# EAGLE schematic GPS_radiologger_v5 (EAGLE 9.5.1)
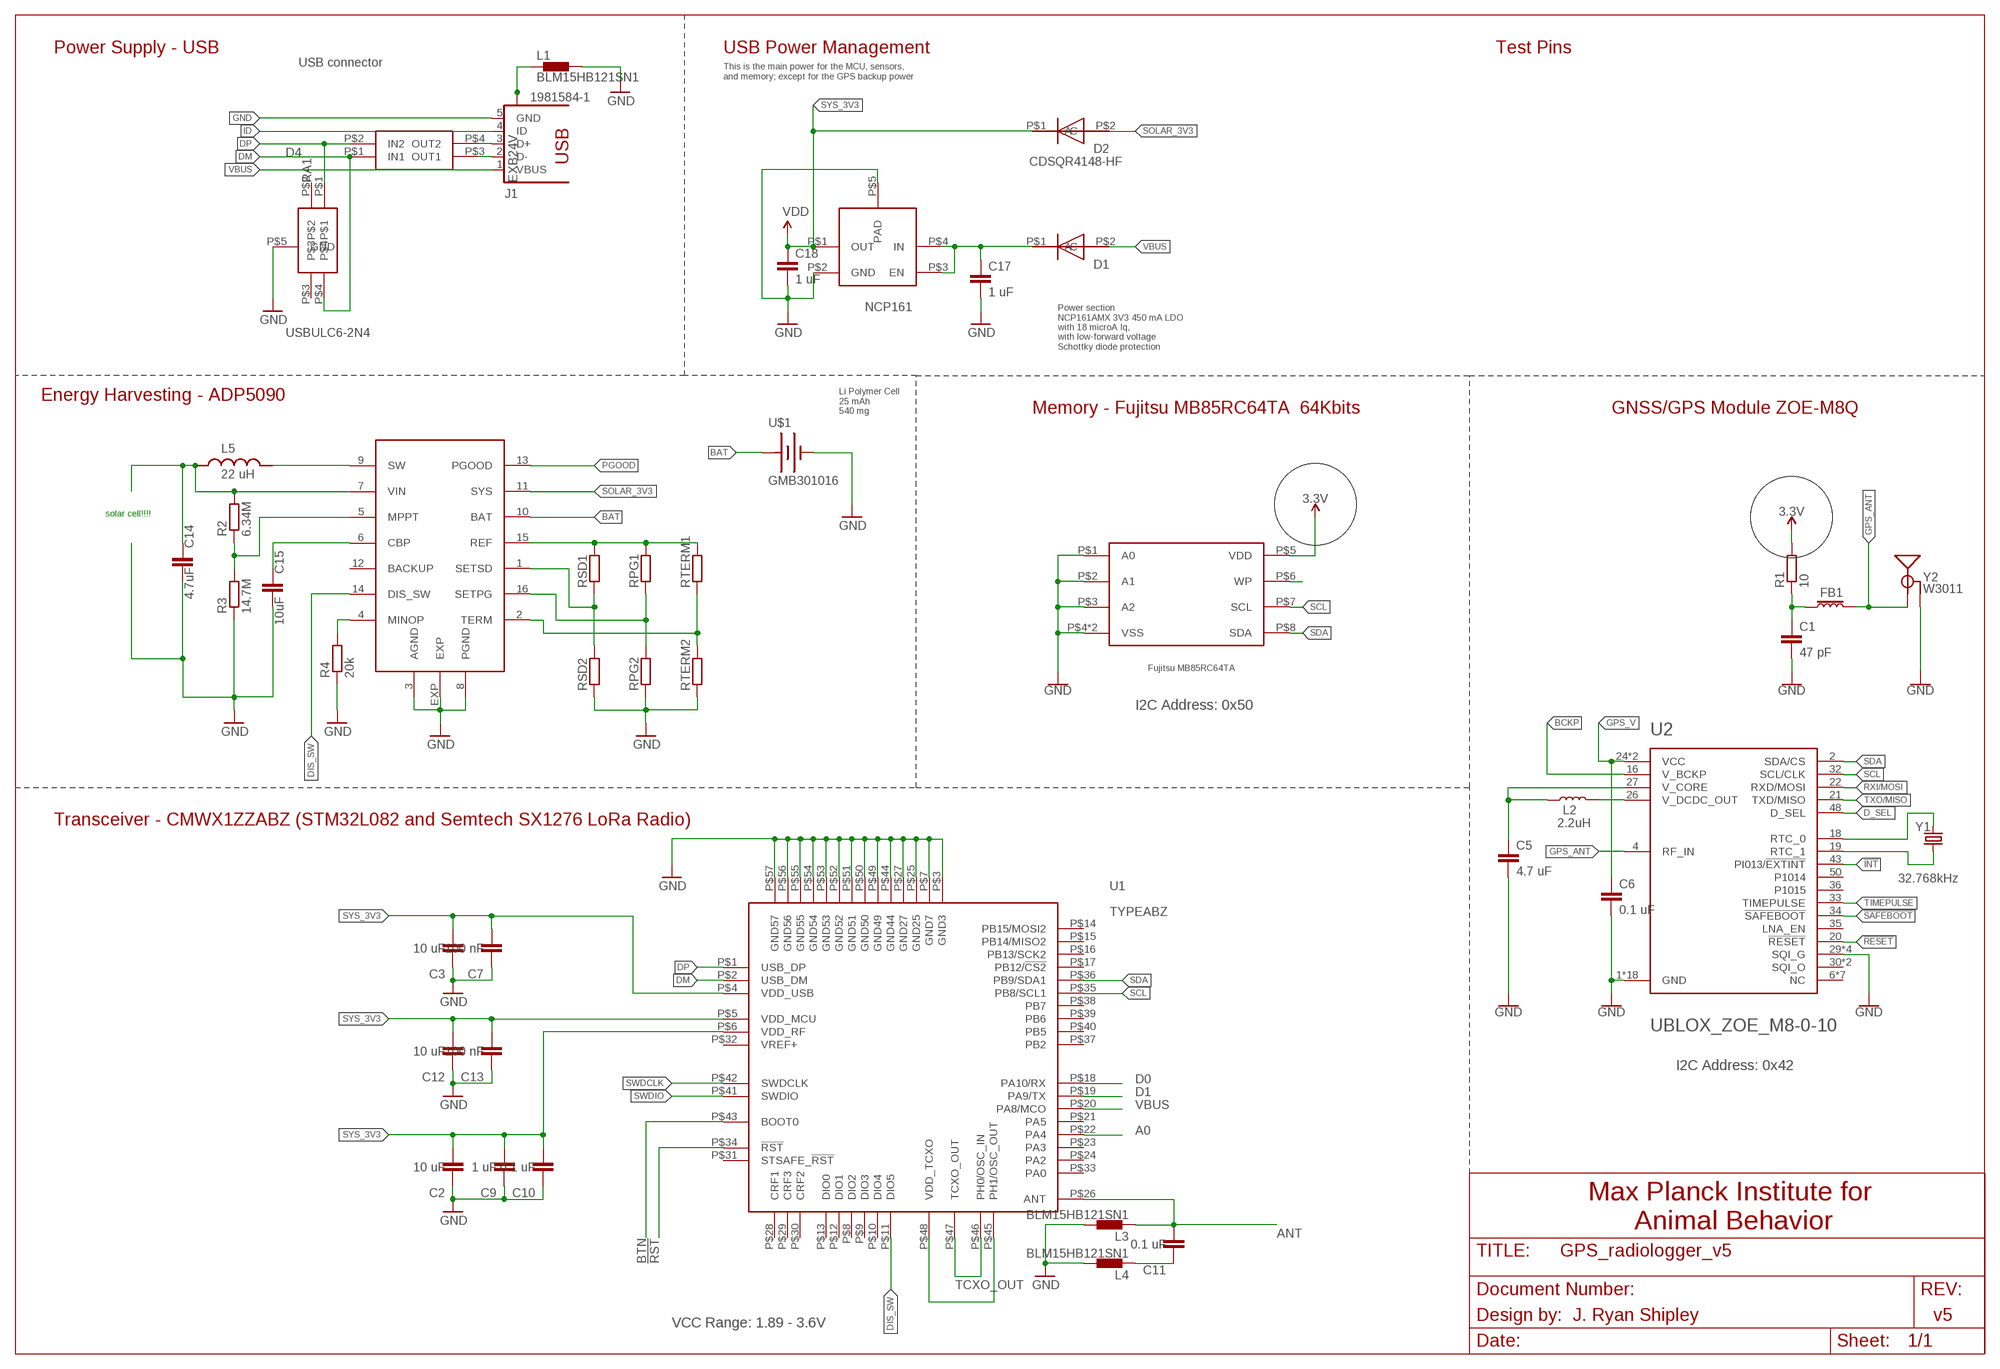
[diagram p0: schematic, sheet 1]

## Parts
C1  47 pF  C-EUC0201  [C0201]
C2  10 uF  C-EUC0201  [C0201]
C3  10 uF  C-EUC0201  [C0201]
C5  4.7 uF  C-EUC0201  [C0201]
C6  0.1 uF  C-EUC0201  [C0201]
C7  100 nF  C-EUC0201  [C0201]
C9  1 uF  C-EUC0201  [C0201]
C10  0.1 uF  C-EUC0201  [C0201]
C11  0.1 uF  C-EUC0201  [C0201]
C12  10 uF  C-EUC0201  [C0201]
C13  100 nF  C-EUC0201  [C0201]
C14  4.7uF  C-EUC0402  [C0402]
C15  10uF  C-EUC0402  [C0402]
C17  1 uF  0402CAP.KW  [0402-CAP]
C18  1 uF  0402CAP.KW  [0402-CAP]
D1  CDSQR4148-HF  [CDSQR4148-HF]
D2  CDSQR4148-HF  [CDSQR4148-HF]
D4  USBULC6-2N4  [USBULC6-2N4]
FB1  FERRITE_BEAD-120_OHM-0402  [0402]
J1  1981584-1  [1981584-1]
L1  BLM15HB121SN1  [0402]
L2  2.2uH  2.2μH_SHIELDED_INDUCTOR  [0806]
L3  BLM15HB121SN1  [0402]
L4  BLM15HB121SN1  [0402]
L5  22 uH  LPS4012-103MRB  [IND_LPS4012-103MRB]
R1  10  R-EU_R0201  [R0201]
R2  6.34M  R-EU_R0201  [R0201]
R3  14.7M  R-EU_R0201  [R0201]
R4  20k  R-EU_R0201  [R0201]
RA1  EXB24V  [EXB24V]
RPG1  R-EU_R0201  [R0201]
RPG2  R-EU_R0201  [R0201]
RSD1  R-EU_R0402  [R0402]
RSD2  R-EU_R0201  [R0201]
RTERM1  R-EU_R0402  [R0402]
RTERM2  R-EU_R0201  [R0201]
U1  TYPEABZ  [TYPEABZ]
U2  UBLOX_ZOE_M8-0-10  [UBLOX_ZOE_M8-0-10]
U5  NCP161  [NCP161]
U$1  GMB301016  [GMB301016]
U$2  MB85RC64TA  [8-SON_2X3]
U$3  ADP5090  [LFCSP-16-3X3]
Y1  32.768kHz  CRYSTAL-32.768KHZSMD-3.2X1.5  [CRYSTAL-SMD-3.2X1.5MM]
Y2  W3011  GPS_CHIP_ANTENNAW3011  [W3011]

## Nets
3.3V: R1.2 U$2.P$5(VDD)
!INT: U2.43(PI013/!EXTINT)
!RESET: U2.20(!RESET)
!RST: U1.P$34(!RST)
!SAFEBOOT: U2.34(!SAFEBOOT)
A0: U1.P$22(PA4)
ANT: C11.1 L4.1
BAT: U$1.+ U$3.10(BAT)
BCKP: U2.16(V_BCKP)
BTN: U1.P$43(BOOT0)
D0: U1.P$18(PA10/RX)
D1: U1.P$19(PA9/TX)
D_SEL: U2.48(D_SEL)
DIS_SW: U1.P$11(DIO5) U$3.14(DIS_SW)
DM: D4.P$4 RA1.P$1(IN1) U1.P$2(USB_DM)
DP: D4.P$1 RA1.P$2(IN2) U1.P$1(USB_DP)
GND: C1.2 C2.1 C3.1 C5.2 C6.2 C7.1 C9.1 C10.1 C12.1 C13.1 C14.2 C15.2 C17.2 C18.2 D4.P$5(GND) J1.5(GND) L1.2 L3.2 L4.2 R3.1 R4.1 RPG2.1 RSD2.1 RTERM2.1 U1.P$3(GND3) U1.P$7(GND7) U1.P$25(GND25) U1.P$27(GND27) U1.P$44(GND44) U1.P$49(GND49) U1.P$50(GND50) U1.P$51(GND51) U1.P$52(GND52) U1.P$53(GND53) U1.P$54(GND54) U1.P$55(GND55) U1.P$56(GND56) U1.P$57(GND57) U2.1(GND) U2.3(GND) U2.5(GND) U2.7(GND) U2.8(GND) U2.9(GND) U2.10(GND) U2.11(GND) U2.12(GND) U2.17(GND) U2.23(GND) U2.29(SQI_G) U2.31(SQI_G) U2.37(GND) U2.38(GND) U2.39(GND) U2.40(GND) U2.41(GND) U2.44(GND) U2.46(SQI_G) U2.47(SQI_G) U2.49(GND) U5.P$2(GND) U5.P$5(PAD) U$1.- U$2.P$1(A0) U$2.P$2(A1) U$2.P$3(A2) U$2.P$4(VSS) U$2.P$9(VSS) Y2.2(GND) Y2.3(GND)
GPS_ANT: FB1.1 U2.4(RF_IN) Y2.1(SIGNAL)
GPS_V: C6.1 U2.24(VCC) U2.25(VCC)
ID: J1.4(ID)
N$1: U1.P$45(PH1/OSC_OUT) U1.P$48(VDD_TCXO)
N$3: U$2.P$6(WP)
N$4: L2.2 U2.26(V_DCDC_OUT)
N$5: L5.2 U$3.9(SW)
N$6: U$3.3(AGND) U$3.8(PGND) U$3.EXP ; supply symbol labelled GND
N$7: R2.1 R3.2 U$3.5(MPPT)
N$8: C15.1 U$3.6(CBP)
N$9: C1.1 FB1.2 R1.1
N$10: R4.2 U$3.4(MINOP)
N$11: RTERM1.1 RTERM2.2 U$3.2(TERM)
N$12: RPG1.1 RPG2.2 U$3.16(SETPG)
N$13: C5.1 L2.1 U2.27(V_CORE)
N$14: U2.18(RTC_0) Y1.P$2
N$15: U2.19(RTC_1) Y1.P$1
N$16: RSD1.1 RSD2.2 U$3.1(SETSD)
N$17: RPG1.2 RSD1.2 RTERM1.2 U$3.15(REF)
N$31: J1.3(D+) RA1.P$4(OUT2)
N$32: C11.2 L3.1 U1.P$26(ANT)
N$33: J1.2(D-) RA1.P$3(OUT1)
N$60: C17.1 D1.P$1(C) U5.P$3(EN) U5.P$4(IN)
PGOOD: U$3.13(PGOOD)
RXI/MOSI: U2.22(RXD/MOSI)
SCL: U1.P$35(PB8/SCL1) U2.32(SCL/CLK) U$2.P$7(SCL)
SDA: U1.P$36(PB9/SDA1) U2.2(SDA/CS) U$2.P$8(SDA)
SOLAR_3V3: D2.P$2(A) U$3.11(SYS)
SWDCLK: U1.P$42(SWDCLK)
SWDIO: U1.P$41(SWDIO)
SYS_3V3: C2.2 C3.2 C7.2 C9.2 C10.2 C12.2 C13.2 C18.1 D2.P$1(C) U1.P$4(VDD_USB) U1.P$5(VDD_MCU) U1.P$6(VDD_RF) U5.P$1(OUT) ; supply symbol labelled VDD
TCXO_OUT: U1.P$46(PH0/OSC_IN) U1.P$47(TCXO_OUT)
TIMEPULSE: U2.33(TIMEPULSE)
TXO/MISO: U2.21(TXD/MISO)
USB_SHIELD: J1.S1 J1.S2 J1.S3 J1.S4 L1.1
VBUS: D1.P$2(A) J1.1(VBUS) U1.P$20(PA8/MCO)
VIN: C14.1 L5.1 R2.2 U$3.7(VIN)
Unconnected: D4.P$2 D4.P$3 U1.P$8(DIO2) U1.P$9(DIO3) U1.P$10(DIO4) U1.P$12(DIO1) U1.P$13(DIO0) U1.P$14(PB15/MOSI2) U1.P$15(PB14/MISO2) U1.P$16(PB13/SCK2) U1.P$17(PB12/!CS2) U1.P$21(PA5) U1.P$23(PA3) U1.P$24(PA2) U1.P$28(CRF1) U1.P$29(CRF3) U1.P$30(CRF2) U1.P$31(STSAFE_!RST) U1.P$33(PA0) U1.P$37(PB2) U1.P$38(PB7) U1.P$39(PB6) U1.P$40(PB5) U2.6(NC) U2.13(NC) U2.14(NC) U2.15(NC) U2.28(NC) U2.30(SQI_O) U2.35(LNA_EN) U2.36(P1015) U2.42(NC) U2.45(SQI_O) U2.50(P1014) U2.51(NC) U$3.12(BACKUP)

## Notes on the sheet
- Power Supply - USB | USB Power Management | Test Pins
- USB connector
- This is the main power for the MCU, sensors,
  and memory; except for the GPS backup power
- Power section
  NCP161AMX 3V3 450 mA LDO
  with 18 microA Iq, 
  with low-forward voltage 
  Schottky diode protection
- Energy Harvesting - ADP5090
- Li Polymer Cell
  25 mAh
  540 mg
- Memory - Fujitsu MB85RC64TA  64Kbits | GNSS/GPS Module ZOE-M8Q
- solar cell!!!!
- I2C Address: 0x50
- Transceiver - CMWX1ZZABZ (STM32L082 and Semtech SX1276 LoRa Radio)
- I2C Address: 0x42
- Max Planck Institute for 
  Animal Behavior
- Design by: | J. Ryan Shipley | v5
- VCC Range: 1.89 - 3.6V

## Power pins joined to a net without a drawn wire
VREF+: U1.P$32(VREF+)

## Library data of the parts
C1-C3 C5-C7 C9-C13 = rcl:C-EU: CAPACITOR, European symbol; SPICEPREFIX: C
C14 C15 = resistor:C-EU: CAPACITOR, European symbol
C17 C18 = SparkFun-Capacitors:0402CAP.KW
D1 D2 = Kris:CDSQR4148-HF: ComChip's CDSQR4148-HF high speed 150 mA Io diode
D4 = Kris:USBULC6-2N4: ST TVS diode ESD Protection USBULC6-2N4
FB1 = SparkFun-Coils:FERRITE_BEAD-120_OHM: Ferrite Bead (blocks, cores, rings, chokes, etc.) Inductor with layers of ferrite used to suppress high frequencies. Often used to isolate high frequency noise.; MFG_PART: BLM15HB121SN1D; PROD_ID: NDUC-14206
J1 = con-usb:1981584-1: Receptacle, micro-USB, type A/B Tyco Electronics; MF: Hirose; MPN: ZX62-AB-5PA(11)
L1 L3 L4 = inductors:BLM15H: EMIFIL (R) Chip Ferrite Bead for GHz Noise Source: http://www.murata.com/ Ferrite Bead BLM15H.pdf
L2 = SparkFun-Coils:2.2μH_SHIELDED_INDUCTOR: Murata 2.2uH Inductor 2.2uH 1.2A 110mOhm 0806 Package Shielded; PROD_ID: NDUC-14257
L5 = LPS4012-103MRB:LPS4012-103MRB: Power inductor, shielded, 20/30% tol, SMT, RoHS, lead-free, halogen-free; AVAILABILITY: Unavailable; DESCRIPTION: Power inductor, shielded, 20/30% tol, SMT, RoHS, lead-free, halogen-free; MF: Coilcraft; MP: LPS4012-103MRB; PACKAGE: None; PRICE: None
R1 RSD1 RTERM1 = rcl:R-EU_: RESISTOR, European symbol; SPICEPREFIX: R
R2-R4 RPG1 RPG2 RSD2 RTERM2 = resistor:R-EU_: RESISTOR, European symbol
RA1 = Kris:EXB24V: Panasonic EXB24 22 Ohm series resistor pair
U1 = Kris:TYPEABZ: CMWX1ZZABZ-078
U2 = SparkFun-GPS:UBLOX_ZOE_M8-0-10: UBLOX ZOE-M8Q-0-10 u-blox ZOE-M8 standard precision GNSS SiP (System in Package) modules feature the high performance u-blox M8 GNSS engine. ZOE-M8’s ultra-miniature form factor integrates a complete GNSS receiver including SAW filter, LNA and TCXO. Handles all GNSS systems and can simulatenously use up to three of them, with accuracy ranging from 2.5m to 4m. GPS GLONASS BeiDou Galileo This can be corrected with the SBAS or QZSS augmentation systems.; PROD_ID: IC-14251
U5 = Kris:NCP161: NCP161 3V3 LDO voltage regulator
U$1 = Powerstream:GMB301016
U$2 = Fujitsu_FRAM:MB85RC64TA
U$3 = ADP5090_LFCSP-16-3X3:ADP5090
Y1 = SparkFun-Clocks:CRYSTAL-32.768KHZ: 32.768kHz Crystal Frequency: 32.768kHz Frequency Stability: ±20ppm Load Capacitance: 12.5pF (PTH-2X6 & SMD-3.2X1.5), 6pF (SMD-2X6) SparkFun Products: SparkFun BigTime Watch Kit <https://www.sparkfun.com/products/11734> SparkFun nRF52832 Breakout <https://www.sparkfun.com/products/13990> SparkFun Real Time Clock Module <https://www.sparkfun.com/products/12708>; PROD_ID: XTAL-13062
Y2 = SparkFun-GPS:GPS_CHIP_ANTENNA; PROD_ID: ANT-14304

## Net classes
1 vcc: width 0 mm